# EAGLE design power (EAGLE 6.1)
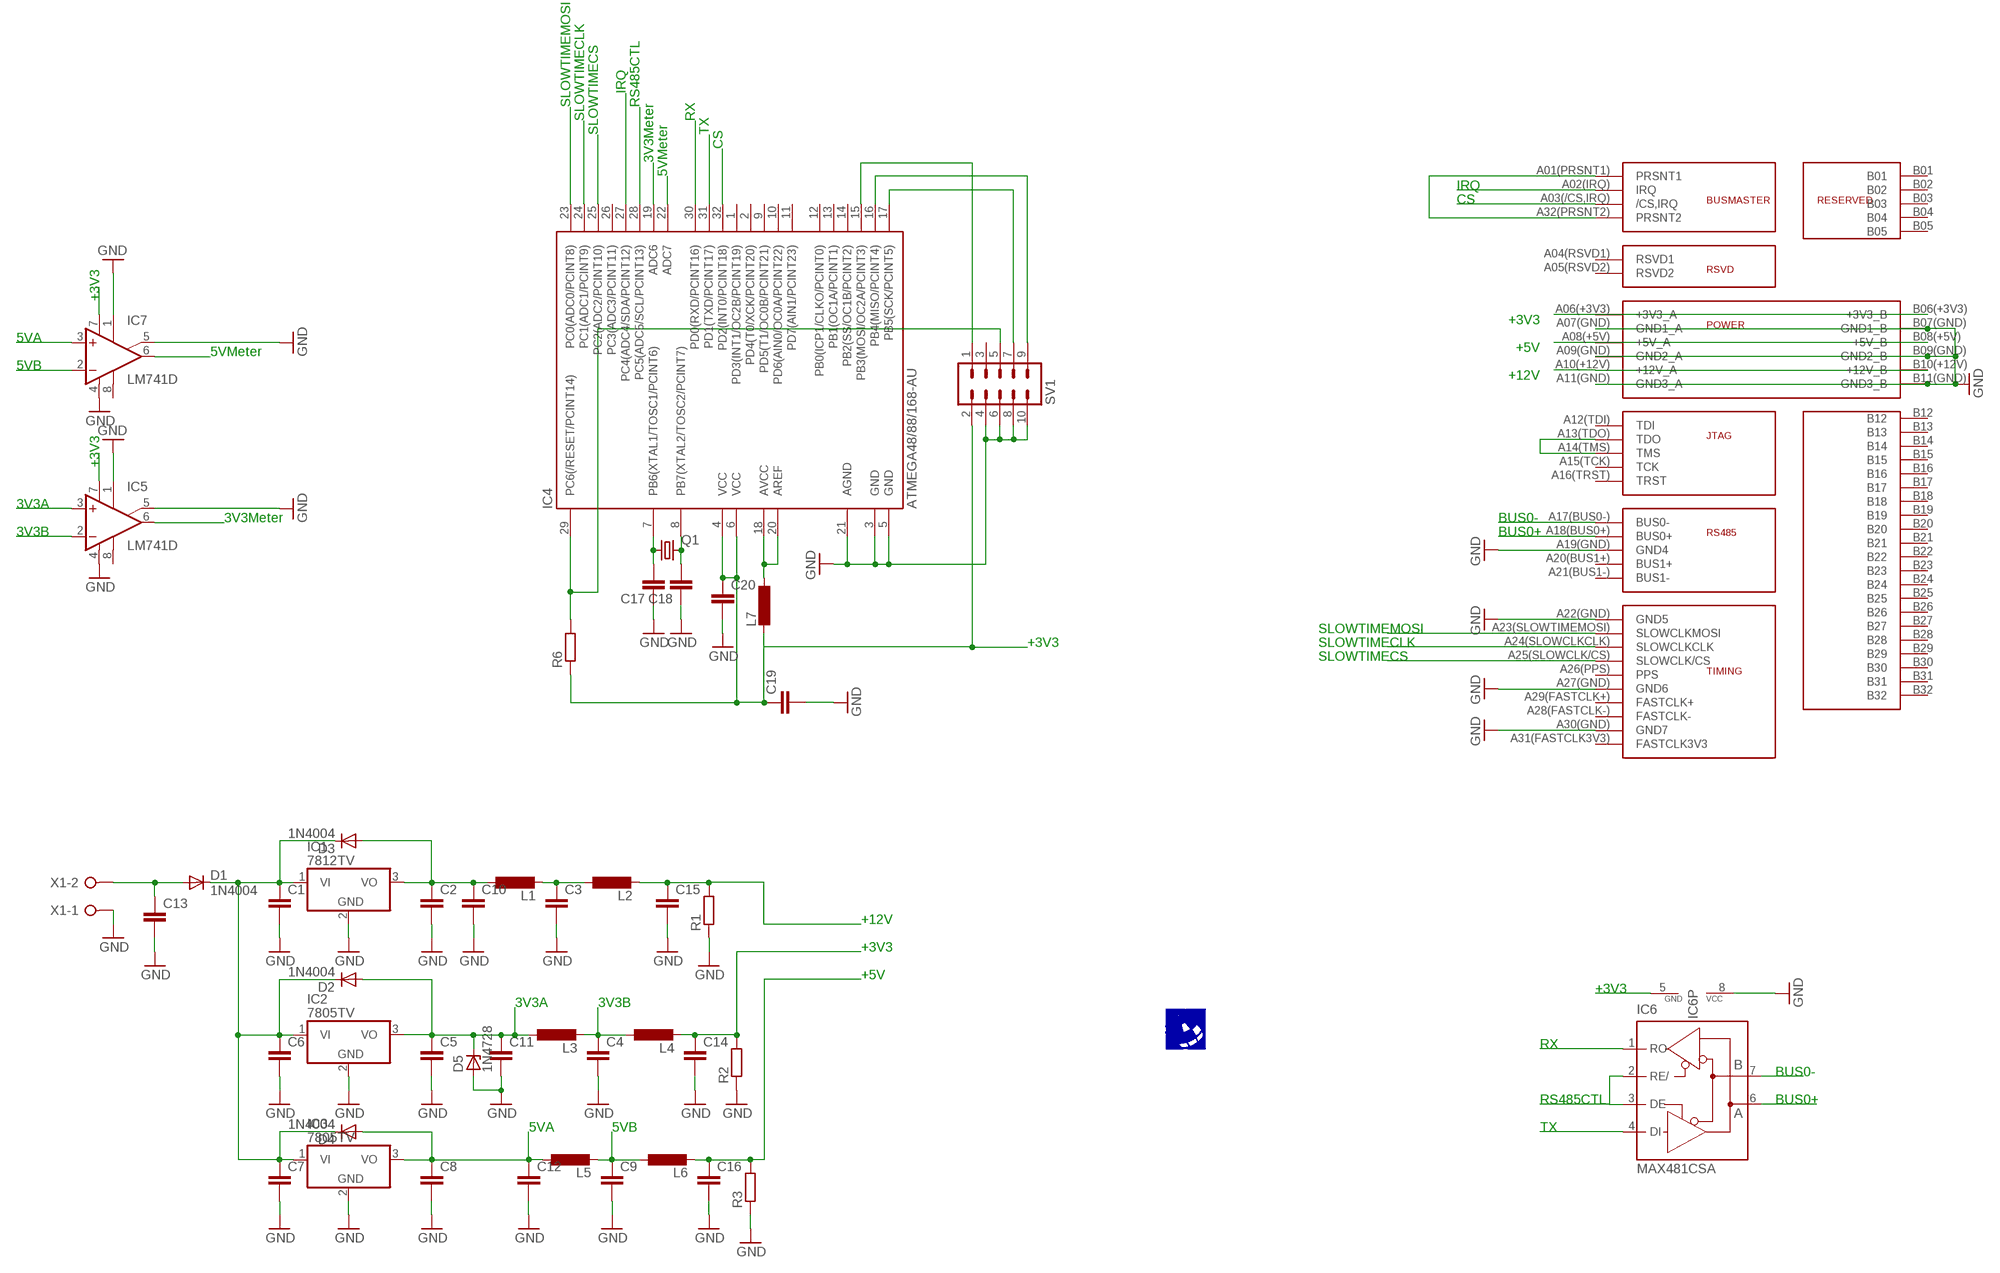
[diagram p0: schematic, sheet 1]

## Parts
C1  C-EUC0805  [C0805]
C2  C-EUC0805  [C0805]
C3  C-EUC0805  [C0805]
C4  C-EUC0805  [C0805]
C5  C-EUC0805  [C0805]
C6  C-EUC0805  [C0805]
C7  C-EUC0805  [C0805]
C8  C-EUC0805  [C0805]
C9  C-EUC0805  [C0805]
C10  C-EU025-050X050  [C025-050X050]
C11  C-EU025-050X050  [C025-050X050]
C12  C-EU025-050X050  [C025-050X050]
C13  C-EU025-060X050  [C025-060X050]
C14  C2.5/6  [C2.5-6]
C15  C2.5/6  [C2.5-6]
C16  C2.5/6  [C2.5-6]
C17  C-EUC0805  [C0805]
C18  C-EUC0805  [C0805]
C19  C-EUC0805  [C0805]
C20  C-EUC0805  [C0805]
D1  1N4004  [DO41-10]
D2  1N4004  [DO41-10]
D3  1N4004  [DO41-10]
D4  1N4004  [DO41-10]
D5  1N4728  [DO41Z10]
IC1  7812TV  [TO220V]
IC2  7805TV  [TO220V]
IC3  7805TV  [TO220V]
IC4  ATMEGA48/88/168-AU  [TQFP32-08]
IC5  LM741D  [SO08]
IC6  MAX481CSA  [SO08]
IC7  LM741D  [SO08]
L1  L-EU0207/5V  [0207/5V]
L2  L-EU0207/5V  [0207/5V]
L3  L-EU0207/5V  [0207/5V]
L4  L-EU0207/5V  [0207/5V]
L5  L-EU0207/5V  [0207/5V]
L6  L-EU0207/5V  [0207/5V]
L7  L-EU0207/5V  [0207/5V]
Q1  CRYSTALHC49U-V  [HC49U-V]
R1  R-EU_0207/15  [0207/15]
R2  R-EU_0207/15  [0207/15]
R3  R-EU_0207/15  [0207/15]
R6  R-EU_R0805  [R0805]
SV1  MA05-2  [MA05-2]
U$1  FRIENDSHIPCONNECTOR  [FRIENDSHIP_EDGE_CONNECTOR]
U$2  HGG_LOGO  [HGG_LOGO]
X1  W237-02P  [W237-132]

## Nets
3V3A: C5.1 C11.1 D2.A D5.C IC2.3(VO) IC5.3(+IN) L3.1
3V3B: C4.1 IC5.2(-IN) L3.2 L4.1
3V3METER: IC4.19(ADC6) IC5.6(OUT)
5VA: C8.1 C12.1 D4.A IC3.3(VO) IC7.3(+IN) L5.1
5VB: C9.1 IC7.2(-IN) L5.2 L6.1
5VMETER: IC4.22(ADC7) IC7.6(OUT)
+3V3: C14.1 C19.1 C20.1 IC4.4(VCC) IC4.6(VCC) IC5.7(V+) IC6.5(GND) IC7.7(V+) L4.2 L7.2 R2.2 R6.1 SV1.2 U$1.A06(+3V3)(+3V3_A) U$1.B06(+3V3)(+3V3_B)
+5V: C16.1 L6.2 R3.2 U$1.A08(+5V)(+5V_A) U$1.B08(+5V)(+5V_B)
+12V: C15.1 L2.2 R1.2 U$1.A10(+12V)(+12V_A) U$1.B10(+12V)(+12V_B)
BUS0+: IC6.6(A) U$1.A18(BUS0+)(BUS0+)
BUS0-: IC6.7(B) U$1.A17(BUS0-)(BUS0-)
BUSCTL: IC4.28(PC5(ADC5/SCL/PCINT13)) IC6.2(RE/) IC6.3(DE)
CS: IC4.32(PD2(INT0/PCINT18)) U$1.A03(/CS,IRQ)(/CS,IRQ)
GND: C1.2 C2.2 C3.2 C4.2 C5.2 C6.2 C7.2 C8.2 C9.2 C10.2 C11.2 C12.2 C13.2 C14.2 C15.2 C16.2 C17.1 C18.1 C19.2 C20.2 D5.A IC1.2(GND) IC2.2(GND) IC3.2(GND) IC4.3(GND) IC4.5(GND) IC4.21(AGND) IC5.1(ON1) IC5.4(V-) IC5.5(ON2) IC6.8(VCC) IC7.1(ON1) IC7.4(V-) IC7.5(ON2) R1.1 R2.1 R3.1 SV1.4 SV1.6 SV1.8 SV1.10 U$1.A07(GND)(GND1_A) U$1.A09(GND)(GND2_A) U$1.A11(GND)(GND3_A) U$1.A19(GND)(GND4) U$1.A22(GND)(GND5) U$1.A27(GND)(GND6) U$1.A30(GND)(GND7) U$1.B07(GND)(GND1_B) U$1.B09(GND)(GND2_B) U$1.B11(GND)(GND3_B) X1.1
IRQ: IC4.27(PC4(ADC4/SDA/PCINT12)) U$1.A02(IRQ)(IRQ)
N$1: C1.1 C6.1 C7.1 D1.C D2.C D3.C D4.C IC1.1(VI) IC2.1(VI) IC3.1(VI)
N$2: C18.2 IC4.8(PB7(XTAL2/TOSC2/PCINT7)) Q1.2
N$5: C2.1 C10.1 D3.A IC1.3(VO) L1.1
N$8: C3.1 L1.2 L2.1
N$12: C13.1 D1.A X1.2
N$13: C17.2 IC4.7(PB6(XTAL1/TOSC1/PCINT6)) Q1.1
N$14: IC4.29(PC6(/RESET/PCINT14)) R6.2 SV1.5
N$15: IC4.18(AVCC) IC4.20(AREF) L7.1
N$16: IC4.16(PB4(MISO/PCINT4)) SV1.9
N$17: IC4.17(PB5(SCK/PCINT5)) SV1.7
N$18: IC4.15(PB3(MOSI/OC2A/PCINT3)) SV1.1
N$20: U$1.A13(TDO)(TDO) U$1.A14(TMS)(TMS)
N$34: U$1.A01(PRSNT1)(PRSNT1) U$1.A32(PRSNT2)(PRSNT2)
RX: IC4.30(PD0(RXD/PCINT16)) IC6.1(RO)
SLOWTIMECLK: IC4.24(PC1(ADC1/PCINT9)) U$1.A24(SLOWCLKCLK)(SLOWCLKCLK)
SLOWTIMECS: IC4.25(PC2(ADC2/PCINT10)) U$1.A25(SLOWCLK/CS)(SLOWCLK/CS)
SLOWTIMEMOSI: IC4.23(PC0(ADC0/PCINT8)) U$1.A23(SLOWTIMEMOSI)(SLOWCLKMOSI)
TX: IC4.31(PD1(TXD/PCINT17)) IC6.4(DI)
Unconnected: IC4.1(PD3(INT1/OC2B/PCINT19)) IC4.2(PD4(T0/XCK/PCINT20)) IC4.9(PD5(T1/OC0B/PCINT21)) IC4.10(PD6(AIN0/OC0A/PCINT22)) IC4.11(PD7(AIN1/PCINT23)) IC4.12(PB0(ICP1/CLKO/PCINT0)) IC4.13(PB1(OC1A/PCINT1)) IC4.14(PB2(SS/OC1B/PCINT2)) IC4.26(PC3(ADC3/PCINT11)) IC5.8(OPT) IC7.8(OPT) SV1.3 U$1.A04(RSVD1)(RSVD1) U$1.A05(RSVD2)(RSVD2) U$1.A12(TDI)(TDI) U$1.A15(TCK)(TCK) U$1.A16(TRST)(TRST) U$1.A20(BUS1+)(BUS1+) U$1.A21(BUS1-)(BUS1-) U$1.A26(PPS)(PPS) U$1.A28(FASTCLK-)(FASTCLK-) U$1.A29(FASTCLK+)(FASTCLK+) U$1.A31(FASTCLK3V3)(FASTCLK3V3) U$1.B01 U$1.B02 U$1.B03 U$1.B04 U$1.B05 U$1.B12 U$1.B13 U$1.B14 U$1.B15 U$1.B16 U$1.B17 U$1.B18 U$1.B19 U$1.B20 U$1.B21 U$1.B22 U$1.B23 U$1.B24 U$1.B25 U$1.B26 U$1.B27 U$1.B28 U$1.B29 U$1.B30 U$1.B31 U$1.B32

## Notes on the sheet
- IRQ
- SLOWTIMEMOSI | RS485CTL
- SLOWTIMECLK | RX
- SLOWTIMECS | TX
- CS
- 3V3Meter
- 5VMeter
- IRQ
- CS
- +3V3
- +3V3
- 5VA | +5V
- 5VMeter
- 5VB | +12V
- +3V3
- 3V3A
- 3V3Meter | BUS0-
- 3V3B | BUS0+
- SLOWTIMEMOSI
- +3V3 | SLOWTIMECLK
- SLOWTIMECS
- +12V
- +3V3
- +5V
- +3V3
- 3V3A | 3V3B
- RX
- BUS0-
- RS485CTL | BUS0+
- 5VA | 5VB | TX

## Library data of the parts
C1-C12 C17-C20 = rcl:C-EU: CAPACITOR, European symbol
C13 = resistor:C-EU: CAPACITOR, European symbol
C14-C16 = capacitor-wima:C: CAPACITOR naming: grid - package width
D1-D4 = diode:1N4004: DIODE general purpose rectifier, 1 A
D5 = diode:1N4728: Z DIODE 3.3 V, 1W, 5 percent
IC1-IC3 = linear:78*: Positive VOLTAGE REGULATOR Source: http://cache.national.com/ds/LM/LM78L05.pdf http://www.fairchildsemi.com/ds/LM/LM7805.pdf
IC4 = atmega8:ATMEGA48/88/168
IC5 IC7 = linear:*741: OP AMP
IC6 = maxim:MAX481CSA: RS485 TRANSEIVER; MF: MAXIM; MPN: MAX481CSA; OC_FARNELL: unknown; OC_NEWARK: 90C3817
L1-L6 = resistor:L-EU: INDUCTOR, European symbol
L7 = rcl:L-EU: INDUCTOR, European symbol
Q1 = crystal:CRYSTAL: CRYSTAL; OC_FARNELL: 1666969; OC_NEWARK: unknown
R1-R3 = rcl:R-EU_: RESISTOR, European symbol
R6 = resistor:R-EU_: RESISTOR, European symbol
SV1 = con-lstb:MA05-2: PIN HEADER; OC_FARNELL: unknown; OC_NEWARK: unknown
U$1 = hgg:FRIENDSHIP
U$2 = hgg:HGG_LOGO
X1 = con-wago-508:W237-02P: WAGO SREW CLAMP; OC_FARNELL: unknown; OC_NEWARK: unknown

## Board
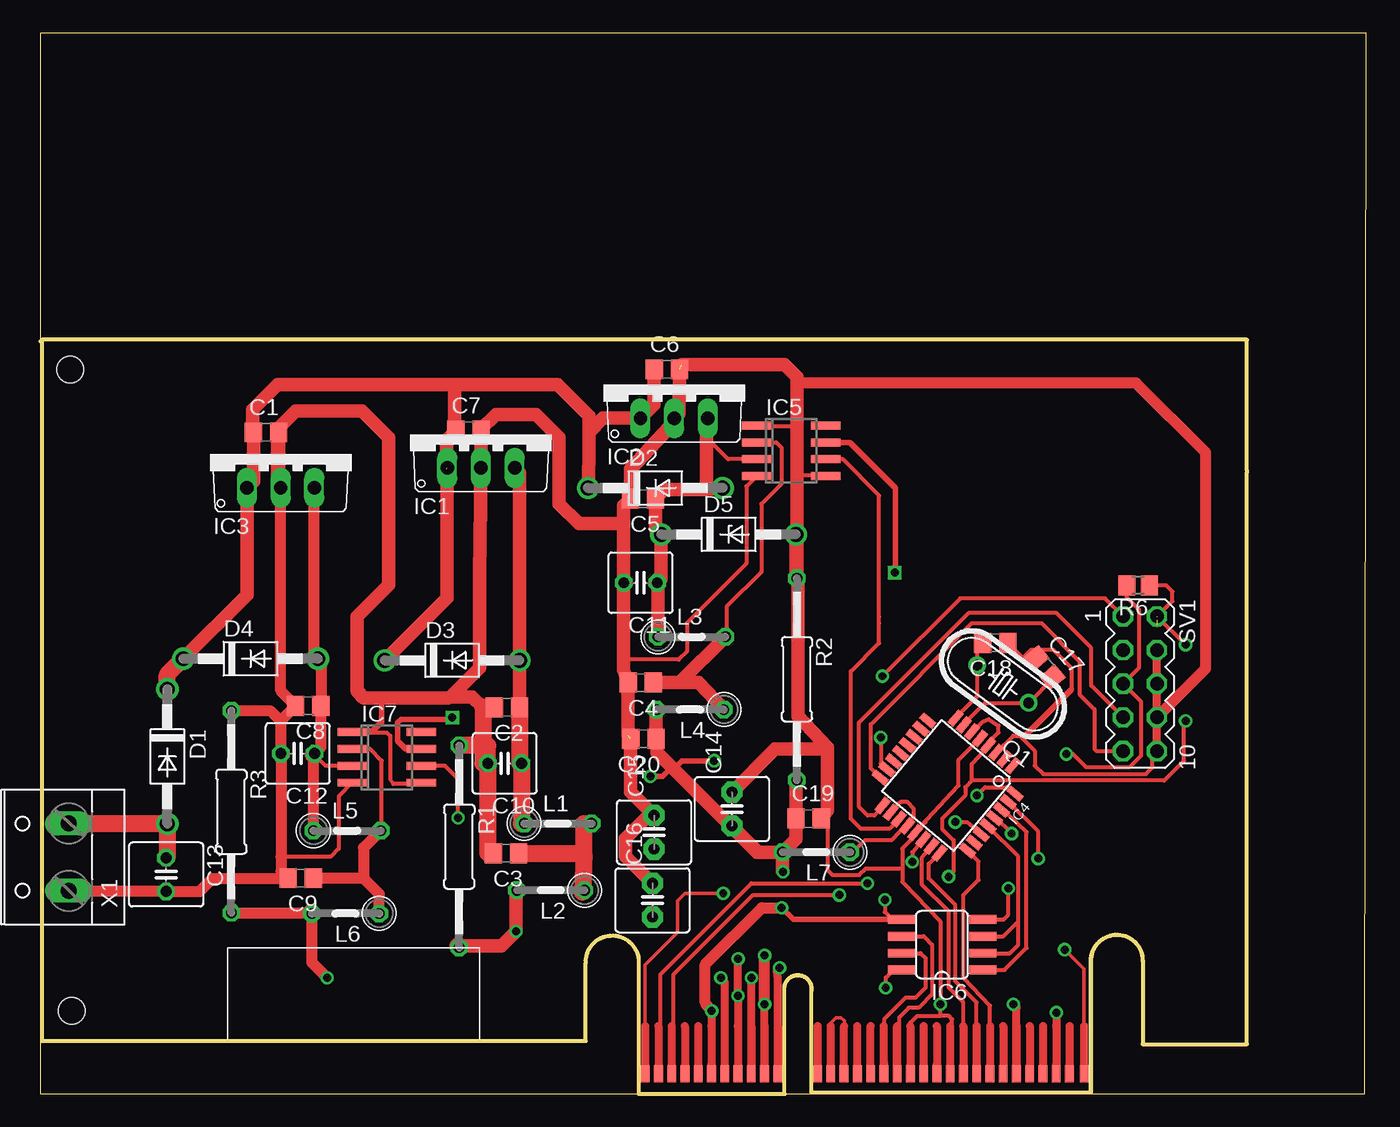
[diagram p1: board, top side]
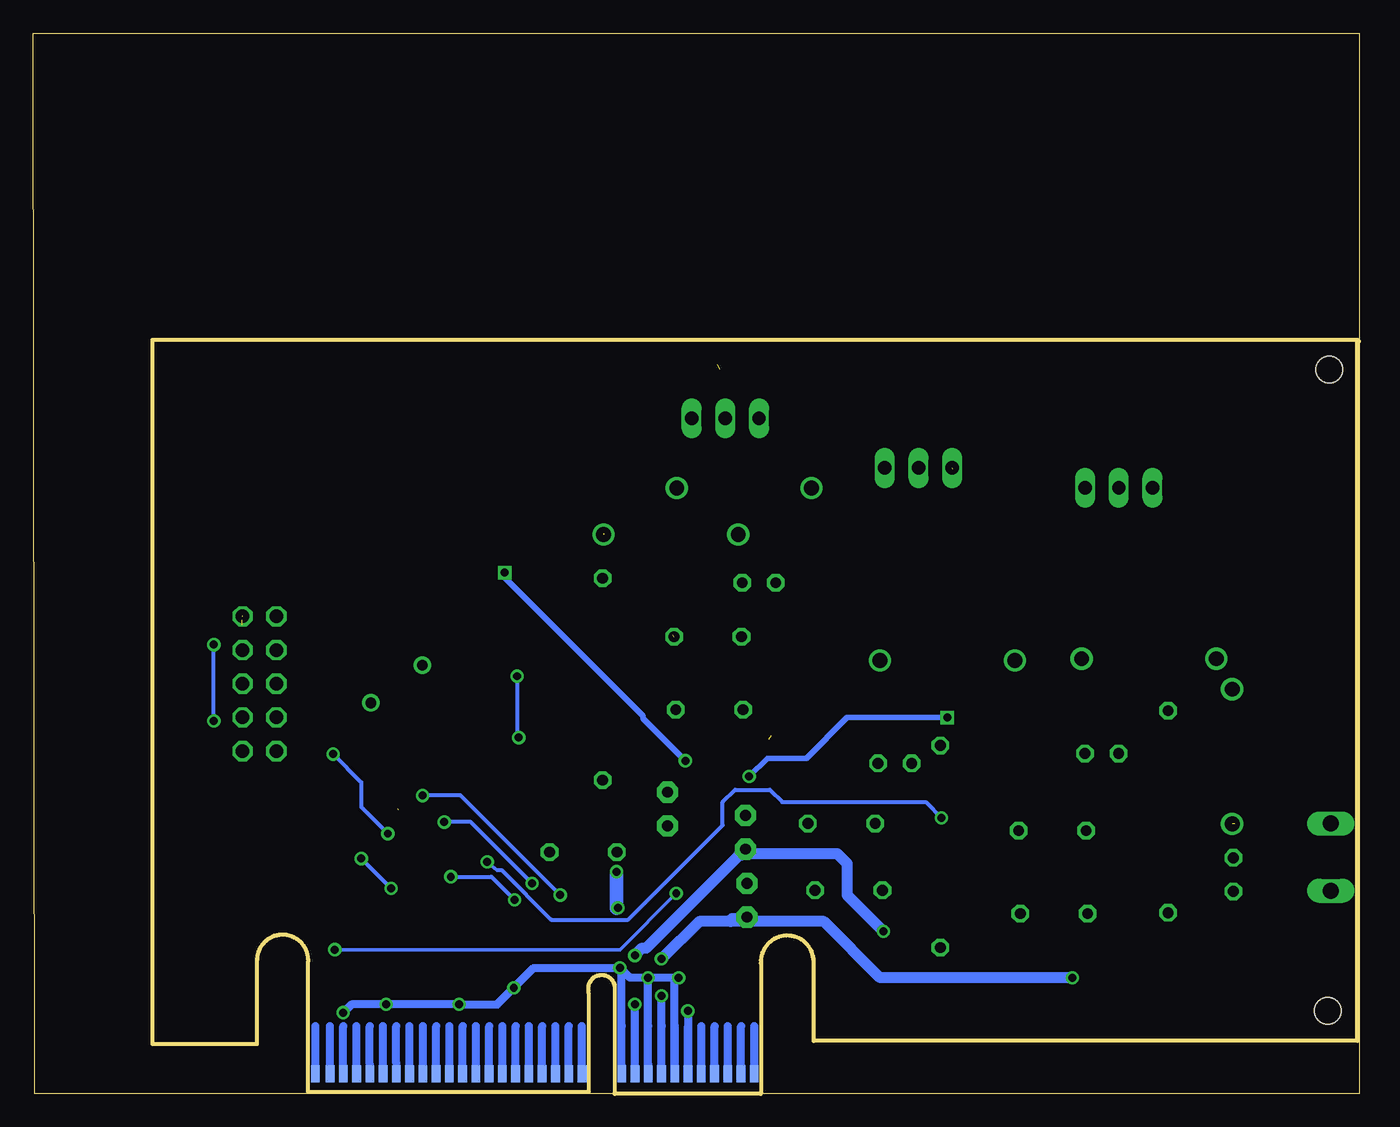
[diagram p2: board, bottom side, seen from below]

Size 100 x 80 mm. Coordinates in mm from the lower left corner, seen from the top.
Outline: 0,56.75 0,80 100,80 99.88,0.25 99.88,0 0,0 0,56.75
Outline: 41.12,9.88 41.12,4 0.12,4 0.12,56.88
Outline: 58.12,7.62 58.12,0.12 79.25,0.12 79.25,10
Outline: 91,46.88 91,3.75 83.12,3.75 83.12,10 arc180 79.25,10.12
Outline: 41.12,10 arc-180 45.12,9.88 45.12,0 56.12,0 56.12,8.12 arc-180 58.12,7.75
Outline: 91,47 91,56.88 0.12,56.88
Outline: 0.12,56.88 0,56.75
Copper layers (1*16): Top 0.035mm / dielectric 1.5mm / Bottom 0.035mm
Design rules: minimum track width 10mil, minimum drill 24mil, track to track 8mil, track to pad 8mil, pad to pad 8mil, via to via 8mil, smd to smd 8mil, copper to edge 40mil, drill to drill 8mil, minimum pad ring 10mil, minimum via ring 8mil, stop-mask expansion 4mil, vias tented up to drill 0mil, thermal gap 10mil
Holes 2 mm at 2.38,6.25 2.25,54.62

### Footprints (pad centres in the part's own frame; a part is rotated, then mirrored left to right if it is on the bottom)
C0805 = smd 1.3 x 1.5: 1 -0.95,0; 2 0.95,0
C025-050X050 = drill 0.813 octagon: 1 -1.27,0; 2 1.27,0
C025-060X050 = drill 0.813 octagon: 1 -1.27,0; 2 1.27,0
C2.5-6 = drill 0.813 pad 1.6 octagon: 1 -1.27,0; 2 1.27,0
DO41-10 = drill 1.118: A 5.08,0; C -5.08,0
DO41Z10 = drill 1.118: A 5.08,0; C -5.08,0
TO220V = drill 1.016 long: 1 -2.54,-2.54; 2 0,-2.54; 3 2.54,-2.54
TQFP32-08 = smd 1.27 x 0.559: 1 -4.293,2.8; 2 -4.293,2; 3 -4.293,1.2; 4 -4.293,0.4; 5 -4.293,-0.4; 6 -4.293,-1.2; 7 -4.293,-2; 8 -4.293,-2.8; 17 4.293,-2.8; 18 4.293,-2; 19 4.293,-1.2; 20 4.293,-0.4; 21 4.293,0.4; 22 4.293,1.2; 23 4.293,2; 24 4.293,2.8 | smd 0.559 x 1.27: 9 -2.8,-4.293; 10 -2,-4.293; 11 -1.2,-4.293; 12 -0.4,-4.293; 13 0.4,-4.293; 14 1.2,-4.293; 15 2,-4.293; 16 2.8,-4.293; 25 2.8,4.293; 26 2,4.293; 27 1.2,4.293; 28 0.4,4.293; 29 -0.4,4.293; 30 -1.2,4.293; 31 -2,4.293; 32 -2.8,4.293
SO08 = smd 0.6 x 2.2: 1 -1.905,-2.6; 2 -0.635,-2.6; 3 0.635,-2.6; 4 1.905,-2.6; 5 1.905,2.6; 6 0.635,2.6; 7 -0.635,2.6; 8 -1.905,2.6
SO08' = smd 0.66 x 2.032: 1 -1.905,-3.073; 2 -0.635,-3.073; 3 0.635,-3.073; 4 1.905,-3.073; 5 1.905,3.073; 6 0.635,3.073; 7 -0.635,3.073; 8 -1.905,3.073
0207/5V = drill 0.813 octagon: 1 -2.54,0; 2 2.54,0
HC49U-V = drill 0.813: 1 -2.413,0; 2 2.413,0
0207/15 = drill 0.813 octagon: 1 -7.62,0; 2 7.62,0
R0805 = smd 1.3 x 1.5: 1 -0.85,0; 2 0.85,0
MA05-2 = drill 1.016 octagon: 1 -5.08,-1.27; 2 -5.08,1.27; 3 -2.54,-1.27; 4 -2.54,1.27; 5 0,-1.27; 6 0,1.27; 7 2.54,-1.27; 8 2.54,1.27; 9 5.08,-1.27; 10 5.08,1.27
FRIENDSHIP_EDGE_CONNECTOR = smd 0.66 x 1.27: A01(PRSNT1) 45.5,-14.5; A02(IRQ) 46.5,-14.5; A03(/CS,IRQ) 47.5,-14.5; A04(RSVD1) 48.5,-14.5; A05(RSVD2) 49.5,-14.5; A06(+3V3) 50.5,-14.5; A07(GND) 51.5,-14.5; A08(+5V) 52.5,-14.5; A09(GND) 53.5,-14.5; A10(+12V) 54.5,-14.5; A11(GND) 55.5,-14.5; A12(TDI) 58.5,-14.5; A13(TDO) 59.5,-14.5; A14(TMS) 60.5,-14.5; A15(TCK) 61.5,-14.5; A16(TRST) 62.5,-14.5; A17(BUS0-) 63.5,-14.5; A18(BUS0+) 64.5,-14.5; A19(GND) 65.5,-14.5; A20(BUS1+) 66.5,-14.5; A21(BUS1-) 67.5,-14.5; A22(GND) 68.5,-14.5; A23(SLOWTIMEMOSI) 69.5,-14.5; A24(SLOWCLKCLK) 70.5,-14.5; A25(SLOWCLK/CS) 71.5,-14.5; A26(PPS) 72.5,-14.5; A27(GND) 73.5,-14.5; A28(FASTCLK-) 74.5,-14.5; A29(FASTCLK+) 75.5,-14.5; A30(GND) 76.5,-14.5; A31(FASTCLK3V3) 77.5,-14.5; A32(PRSNT2) 78.6,-14.5 | smd 0.66 x 1.27 bottom: B01 45.5,-14.5; B02 46.5,-14.5; B03 47.5,-14.5; B04 48.5,-14.5; B05 49.5,-14.5; B06(+3V3) 50.5,-14.5; B07(GND) 51.5,-14.5; B08(+5V) 52.5,-14.5; B09(GND) 53.5,-14.5; B10(+12V) 54.5,-14.5; B11(GND) 55.5,-14.5; B12 58.5,-14.5; B13 59.5,-14.5; B14 60.5,-14.5; B15 61.5,-14.5; B16 62.5,-14.5; B17 63.5,-14.5; B18 64.5,-14.5; B19 65.5,-14.5; B20 66.5,-14.5; B21 67.5,-14.5; B22 68.5,-14.5; B23 69.5,-14.5; B24 70.5,-14.5; B25 71.5,-14.5; B26 72.5,-14.5; B27 73.5,-14.5; B28 74.5,-14.5; B29 75.5,-14.5; B30 76.5,-14.5; B31 77.5,-14.5; B32 78.6,-14.5
W237-132 = drill 1.194 long: 1 -2.54,-0.635; 2 2.54,-0.635

### Placement (x,y rotation side)
C1  17.02,49.9 0 top
C2  35.19,29.14 180 top
C3  35.11,18.14 180 top
C4  45.28,31.02 180 top
C5  45.45,44.9 180 top
C6  47.24,54.65 0 top
C7  32.29,50.02 0 top
C8  20.21,29.27 180 top
C9  19.63,16.27 180 top
C10  35.01,24.93 180 top
C11  45.26,38.55 180 top
C12  19.41,25.67 180 top
C13  9.48,16.54 270 top
C14  52.16,21.48 90 top
C15  46.28,19.73 90 top
C16  46.16,14.61 90 top
C17  75.72,32.15 310.2 top
C18  72.01,34.02 180 top
C19  57.93,20.77 0 top
C20  45.48,26.77 180 top
D1  9.57,25.45 270 top
D2  46.38,45.7 0 top
D3  31.05,32.7 0 top
D4  15.85,32.82 0 top
D5  51.9,42.2 0 top
IC1  33.23,49.74 0 top
IC2  47.8,53.49 0 top
IC3  18.12,48.24 0 top
IC4  68.42,23.25 230.1 top
IC5  56.62,48.5 270 top
IC6  MAX481CSA  [SO08']  68,11.25 90 top
IC7  26.12,25.38 270 top
L1  39.03,20.39 0 top
L2  38.49,15.35 180 top
L3  49.12,34.48 0 top
L4  49,28.98 180 top
L5  23.13,19.85 0 top
L6  23.01,13.6 180 top
L7  58.52,18.23 180 top
Q1  72.59,30.91 143.8 top
R1  31.59,18.65 270 top
R2  57.05,31.27 270 top
R3  14.4,21.27 270 top
R6  82.79,38.35 180 top
SV1  82.93,30.93 270 top
U$1  0.11,16.01 0 top
U$2  71.5,42.5 0 top
X1  1.5,17.86 90 top

### Tracks (layer width: path | path; a pad name or v marks a point on that pad's centre or on a via)
3V3A
  Top 0.305: IC5.3 51.88,47.88 50.25,49.5 50.25,49.75
  Top 1.016: L3.1 46.58,38.49 C11.1 46.82,38.84 D5.C 46.4,42.62 C5.1 47.08,45.57 50.25,45.57 | D2.A 50.25,45.57 | IC2.3 50.25,50.86 50.25,49.75 50.25,45.57
3V3B  (1 unrouted)
  Top 0.305: IC5.2 54.03,49.12 55.5,49.12 55.88,48.75 55.88,46 54.38,44.5 54.38,39.38 51.75,36.75 51.75,34.62
  Top 1.016: L4.1 49.62,31.02 48.2,31.02 | L3.2 48.2,31.02 | 48.2,31.02 C4.1
3V3METER
  Top 0.305: IC5.6 60.51,47.87 63.25,45.12 63.25,36 63.25,35.5 63.25,34 61.12,31.88 61.12,20.75 61.88,20 64.02,20 IC4.19
5VA
  Top 0.305: IC7.3 21.5,24.75 20.68,25.57 C12.1
  Top 0.813: L5.1 20.59,25.58 | 21.16,32.59 C8.1 21.16,26.15 C12.1 | 20.66,33.09 IC3.3
  Top 1.016: 21.16,32.59 D4.A 20.66,33.09
  Top 1.27: 20.59,25.58 C12.1
5VB
  Top 0.305: L5.2 25.75,19.93 25.75,25.12 24.86,26.01 IC7.2
  Top 0.813: L6.1 25.55,15.07 24.38,16.25 | 24.38,16.25 20.6,16.25 | L5.2 24.38,18.55 24.38,16.25
  Top 1.27: 20.6,16.25 C9.1
5VMETER  (via drill 0.6)
  Top 0.305: IC4.22 65.75,18.23 v65.75,17.5 | v31.5,20.81 31.5,23.75 30.51,24.74 IC7.6
  Bottom 0.305: v65.75,17.5 65,16.88 64.69,16.88 60.94,13.12 55.12,13.12 48,20.25 48,22 47.06,22.94 44.44,22.94 43.5,22 32.69,22 v31.5,20.81
+3V3  (via drill 0.6)  (2 unrouted)
  Top 0.305: 70.25,23.62 84.75,23.62 86.25,25.12 86.25,28 v86.38,28.12 | 70.25,23.62 70.25,24.88 | 70.25,24.88 70.88,25.56 IC4.4 | IC4.4 71.48,26.23 70.25,24.88 | IC4.4 71.48,26.48 72.25,27.25 72.25,27.75 71.5,28.25 71,28 70.31,27.31 | 70.31,27.31 70.25,27.25 | IC4.6 70.31,27.31 | IC6.5 64.25,13.15 63.69,13.72 v63.69,14.62 | 50.62,1.62 U$1.B06(+3V3) | v56,16.75 55.98,16.77 | 70.25,23.62 69.75,23.12 69.75,22.5 68,20.75 68,20 68.88,19.12 68.88,16.75 v68.5,16.38 | 56.98,23.58 R2.2 | SV1.2 85.38,37.16 85.38,37.88 84.9,38.35 R6.1 | 84.2,35.33 84.25,35.38 | 84.25,35.75 84.38,35.88 84.38,36 84.25,36 | v86.38,33.88 86.33,33.88 SV1.2
  Top 0.406: 64.25,13.15 56.78,13.15 v55.91,14.03 | IC7.7 27.55,26.01 26.94,26.62 26.94,28 27.19,28.25 30.94,28.25 v31.06,28.38 | v46,23.94 46.94,23.94 47.62,24.62 | IC5.7 61.05,49.13 64.5,45.69 64.5,39.38 v64.44,39.31 | v50.81,25.12 48.38,25.12 47.75,24.5
  Top 0.61: v50.62,6.25 50.62,1.62 | SV1.2
  Top 0.813: v50.62,6.25 50.12,6.88 50.12,9.75 54.41,14.03 v55.91,14.03
  Top 1.016: L7.2 54.02,18.23 53.88,18.38 | 53.88,18.38 47.75,24.5 47.62,24.62 46.5,25.75 46.5,26.7 C20.1 46.42,28.94 L4.2 | L7.2 56.98,19.23 C19.1 56.98,23.58 | 55.98,16.77 L7.2 | C14.1 53.88,18.49 53.88,18.38
  Bottom 0.305: 50.62,1.62 U$1.B06(+3V3) | 55.88,15.88 v56,16.75 | v68.5,16.38 65.44,16.38 v63.69,14.62 | v86.38,28.12 v86.38,33.88
  Bottom 0.406: v31.06,28.38 38.62,28.38 41.69,25.31 44.62,25.31 v46,23.94 | v64.44,39.31 64.44,38.94 54,28.5 54,28.31 v50.81,25.12
  Bottom 0.61: v50.62,6.25 50.62,1.62
  Bottom 1.016: v55.91,14.03 56,14 v56,16.75
+5V  (via drill 0.6)
  Top 0.305: 52.5,1.62 U$1.B08(+5V) | v52.61,7.39 52.62,7.41
  Top 0.61: 52.62,7.41 v52.62,10.19 | v52.61,7.39 U$1.B08(+5V)
  Top 0.813: R3.2 20.41,13.65 | L6.2 20.47,9.9 v21.62,8.75
  Top 1.27: 20.41,13.65 L6.2
  Bottom 0.61: U$1.B08(+5V) v52.61,7.39
  Bottom 0.813: v21.62,8.75 36.12,8.75 40.38,13 47.38,13 | 47.38,13 49.75,13 v52.62,10.19 | 47.25,13.12 47.38,13
  Bottom 1.016: C16.1 46.7,13.12 47.25,13.12
+12V  (via drill 0.6)
  Top 0.305: v54.62,6.75 54.61,6.89 54.62,6.91
  Top 0.61: U$1.B10(+12V) 54.61,6.89
  Top 0.813: 54.62,6.91 v54.62,10.44
  Top 1.016: L2.2 35.88,15.28 v35.88,12.25 34.78,11.15 31.5,11.15
  Top 1.27: L2.2 35.95,15.38 | 31.5,11.15 R1.2
  Bottom 0.305: 54.61,6.89 v54.62,6.75
  Bottom 0.61: U$1.B10(+12V) 54.61,6.89
  Bottom 0.813: v54.62,10.44 54.06,11 53.75,11 46.62,18.12 39.38,18.12 38.62,17.38 38.62,15 v35.88,12.25
  Bottom 1.016: 46.62,18.12 46.59,18.09 C15.1
BUS0+
  Top 0.305: IC6.6 66.61,11.88 67.25,11.25 67.25,7.5 66.25,6.5 65.5,6.5 64.75,5.75 64.75,1.65 U$1.A18(BUS0+)
BUS0-
  Top 0.305: IC6.7 66.39,10.62 66.75,10.25 66.75,8 66,7.25 65.25,7.25 63.62,5.62 63.75,2 63.5,1.75 | 63.5,1.75 63.5,1.25 | U$1.A17(BUS0-) 63.61,1.64 63.5,1.75
BUSCTL
  Top 0.305: IC6.2 73.11,10.62 73.75,11.25 73.75,13 | 73.75,13 73.75,17.9 IC4.28 | IC6.3 72.64,11.88 73.75,13
CS  (via drill 0.6)
  Top 0.305: U$1.A03(/CS,IRQ) 47.75,1.65 47.75,9 53.75,15 v60.25,15 | v70.62,22.5 71.25,23.12 72.88,23.12 73.36,22.64 IC4.32
  Bottom 0.305: v60.25,15 67.75,22.5 v70.62,22.5
GND  (via drill 0.6)  (3 unrouted)
  Top 0.305: U$1.A19(GND) 65.61,5.36 66.12,5.88 67.88,5.88 | U$1.A22(GND) 68.75,1.65 68.75,5.62 68.5,5.88 67.88,5.88 | v63.75,8 63.75,8.75 64.25,9.25 64.83,9.25 IC6.8 | 67.88,5.88 v67.88,6.75 67.88,13 65,16 65,17 | 76.62,1.62 U$1.A30(GND) | 65.75,19.25 65.97,19.47 IC4.21 65.97,19.72 69.25,23.25 69.25,25.18 IC4.5 | 65.75,19.25 65,18.5 65,17 | 74.1,32.88 C17.1 75.11,32.61 | 74.1,32.88 C18.1 | 53.5,1.62 U$1.A09(GND) 53.62,1.65 | C19.2 59.11,21 | 66.75,20.5 65.75,19.5 65.75,19.25 | U$1.B11(GND) 55.62,1.62 | U$1.B07(GND) 51.62,1.62 | IC5.1 54.05,50.38 57.05,50.38 | IC5.5 59.2,46.62 57.05,46.62 | IC5.4 53.25,45.82 53.25,40 48.75,35.5 48.75,33.38 48.12,32.75 43.99,32.75 | IC7.5 28.25,23.38 26.62,23.38 26.38,23.75 26.38,27 26.12,27.25 23.18,27.25 IC7.1 23.43,27.38 | IC7.4 22.5,22.45 22.5,18.5 21.88,17.88 18.14,17.88 | 59.38,21.39 59.38,16.88 59.75,16.5 61.75,16.5 62.25,17 65,17 | 74.1,32.88 74.11,32.88 75.5,32.88 75.75,33.12 | 74.1,32.88 74.73,33.5 76.38,33.5 77.75,32.12 77.75,30.5 | 74.25,27 73.88,27 | IC4.3 72.15,25.77 73.38,27 73.88,27 | 73.88,27 75,25.88 75,24.75 75.62,24.12 83.38,24.12 83.88,24.62 83.88,25.52 SV1.10
  Top 0.406: 74.25,27 77.75,30.5 | 23.43,27.38 25.06,27.38 25.75,28.06 25.75,29.88
  Top 0.61: v76.62,6.12 76.62,1.62 | 55.62,1.62 55.62,8.69 55.56,9.31 v55.75,9.5 | 53.62,1.65 v53.62,8.75 | 51.62,1.62 51.62,8.44 v51.31,8.75 | SV1.10 SV1.8 SV1.6 SV1.4 | U$1.A27(GND) 73.61,6.51 v73.38,6.75
  Top 0.813: 2.19,15.27 C13.2 12.02,15.27 13,16.25 18.66,16.25 | C9.2 18.14,16.81 18.14,17.88 C12.2 18.14,28.15 C8.2 | 14.42,28.88 17.38,28.88 18.12,28.12 C8.2 18.12,30.4 IC3.2 | 57.05,53.62 82.62,53.62 87.88,48.38 87.88,32.06 SV1.8
  Top 1.016: 44.33,27.05 C4.2 43.99,31.98 43.99,32.75 C11.2 43.99,43 | 43.99,43 43.99,44.38 C5.2 44.5,47.12 47.92,50.8 | 47.92,50.8 IC2.2 48.17,51.29 C6.2 | R2.1 57.05,42.12 | 57.05,42.12 D5.A | 47.92,50.8 47.88,51 | 57.05,42.12 57.05,46.62 57.05,50.38 57.05,53.62 57.05,54.07 56.12,55 48.38,55 | C19.2 59.38,21.39 59.38,26 | 59.38,26 59.38,26.12 57.12,28.5 57.12,39 57,39.12 57,42.25 | IC1.2 C7.2 | C1.2 17.97,45.85 IC3.2 17.88,45.95 17.88,50.12 19.25,51.5 24.25,51.5 26.25,49.5 26.25,38.38 23.88,36 23.88,30.38 24.38,29.88 25.75,29.88 30.75,29.88 30.94,29.94 | IC1.2 33.25,47.22 33.25,50.12 34.38,51.25 37.38,51.25 39.12,49.5 39.12,44.5 40.62,43 43.99,43 | 30.94,29.94 33.12,32.12 33.12,38.5 33.1,39.15 IC1.2 | 33.38,29.12 32.56,29.94 30.94,29.94 | C20.2 44.52,22.76 C15.2 45.88,21 44.12,19.25 44.12,17.91 C16.2 | C14.2 55.41,26 59.38,26
  Top 1.27: 2.19,15.27 X1.1 | 18.66,16.25 C9.2 | C8.2 | 14.42,28.88 R3.1 | 33.48,29.14 C2.2 34.24,29.12 33.38,29.12 33.38,24.93 C10.2 | C10.2 33.74,26.27 R1.1 | C10.2 33.74,18.14 C3.2
  Bottom 0.305: U$1.B07(GND) 51.62,1.62 | U$1.A09(GND) 53.62,1.77 | U$1.B11(GND) 55.62,1.62
  Bottom 0.61: v76.62,6.12 76,6.75 v73.38,6.75 v67.88,6.75 65,6.75 v63.75,8 62.25,9.5 v55.75,9.5 55.62,9.38 | v53.62,8.75 v51.31,8.75 51.62,8.44 51.62,1.62 | v53.62,8.75 55,8.75 55.62,9.38 | 53.62,1.77 v53.62,8.75 | 55.62,1.62 55.62,9.38
IRQ  (via drill 0.6)
  Top 0.305: U$1.A02(IRQ) 46.75,1.65 46.75,9 53.62,15.88 v62.38,15.88 | v69,20.5 69.88,20.5 70.8,19.7 IC4.27
  Bottom 0.305: v62.38,15.88 67,20.5 v69,20.5
N$1  (1 unrouted)
  Top 0.305: D2.C 41.12,45.62
  Top 1.016: C6.1 46.3,51.98 IC2.1 42.45,50.95 41.38,49.88 | 41.38,49.88 41.38,47.99 D2.C | 31.25,53.5 39,53.5 41.38,51.12 41.38,49.88 | 31.25,53.5 31.25,50.11 C7.1 30.62,49.3 30.62,47.12 | D3.C 30.69,37.41 IC1.1 | D4.C 15.58,37.63 IC3.1 16.07,46.19 C1.1 16,49.97 16,51.62 17.88,53.5 31.25,53.5
  Top 1.27: D1.C 9.57,31.62 D4.C
N$2
  Top 0.305: C18.2 70.64,33.6 Q1.2 70.64,29.96 IC4.8
N$5
  Top 1.016: IC1.3 36.13,46.84 D3.A 36.14,32.69 C2.1
  Top 1.27: 36.02,32.7 D3.A | C2.1 36.14,24.93 C10.1 36.28,20.39 L1.1
N$8
  Top 1.27: C3.1 36.06,18.12 41,18.12 | 41,18.12 41,20.39 L1.2 | 41,18.12 40.88,15.22 L2.1
N$12  (1 unrouted)
  Top 1.27: X1.2 9.36,20.39 9.38,20.38 | D1.A 9.57,17.9 C13.1
N$13
  Top 0.305: IC4.7 69.64,27.89 71.25,29.5 74.52,29.5 Q1.1 76.33,31.28 C17.2
N$14  (via drill 0.6)
  Top 0.305: v73.25,19.62 72.07,20.8 IC4.29 | v77.38,25.62 77.88,25.62 78.88,24.62 82.12,24.62 83,25.5 83,29.59 SV1.5 82.88,32.15 82.88,36.5 81.94,37.44 R6.2
  Bottom 0.305: v77.38,25.62 75.25,23.5 75.25,21.62 v73.25,19.62
N$15
  Top 0.305: L7.1 61.1,18.1 62.19,19.12 64.19,19.12 65.36,20.36 | 65.36,20.36 IC4.20 | 64.24,21.24 IC4.18 64.13,21.26 64.88,22 65.38,22 65.88,21.5 65.88,20.88 65.36,20.36
N$16
  Top 0.305: IC4.16 62.62,24.56 62.62,27.88 70.25,35.5 75.5,35.5 78.38,32.62 78.38,30.12 79.5,29 79.5,26 79.65,25.85 SV1.9
N$17
  Top 0.305: IC4.17 62.89,21 62.38,21 61.75,21.62 61.75,28 70,36.25 76.62,36.25 79.25,33.62 79.25,30.8 SV1.7
N$18  (via drill 0.6)
  Top 0.305: SV1.1 80.3,37.38 69.38,37.38 v63.5,31.5 | v63.38,26.88 63.38,24.94 IC4.15
  Bottom 0.305: v63.5,31.5 63.5,27 v63.38,26.88
N$20
  Top 0.254: U$1.A13(TDO) 59.62,1.52 59.62,5.38 60,5.75 60.38,5.75 60.62,5.5 60.62,1.52 U$1.A14(TMS)
N$34  (via drill 0.6)
  Top 0.254: U$1.A32(PRSNT2) 78.71,9.41 v77.25,10.88 | U$1.A01(PRSNT1) 45.61,9.73 48.06,12.19 48.06,14.56 48.62,15.12 v51.5,15.12
  Bottom 0.254: 77.5,10.88 v77.25,10.88 55.75,10.88 v51.5,15.12
RX  (1 unrouted)
  Top 0.305: IC6.1 72.72,9.35 74.38,11 74.38,19.75 72.5,21.5
SLOWTIMECLK
  Top 0.305: U$1.A24(SLOWCLKCLK) 70.61,6.89 69,8.5 69,14.25 67,16.25 67,17.35 IC4.24
SLOWTIMECS
  Top 0.305: U$1.A25(SLOWCLK/CS) 71.61,6.64 69.62,8.75 69.62,15 70.75,16.12 70.75,17.52 IC4.25
SLOWTIMEMOSI
  Top 0.305: U$1.A23(SLOWTIMEMOSI) 69.61,6.89 68.5,8 68.5,13.75 66.5,15.75 66.5,17.85 IC4.23
TX  (via drill 0.6)
  Top 0.305: IC6.4 72.66,13.15 73,13.5 v73,15.5 | v75.25,17.75 75.25,19.78 IC4.31
  Bottom 0.305: v73,15.5 v75.25,17.75